# EAGLE schematic StrainGageAmpSMD3v3 (EAGLE 9.1.0)
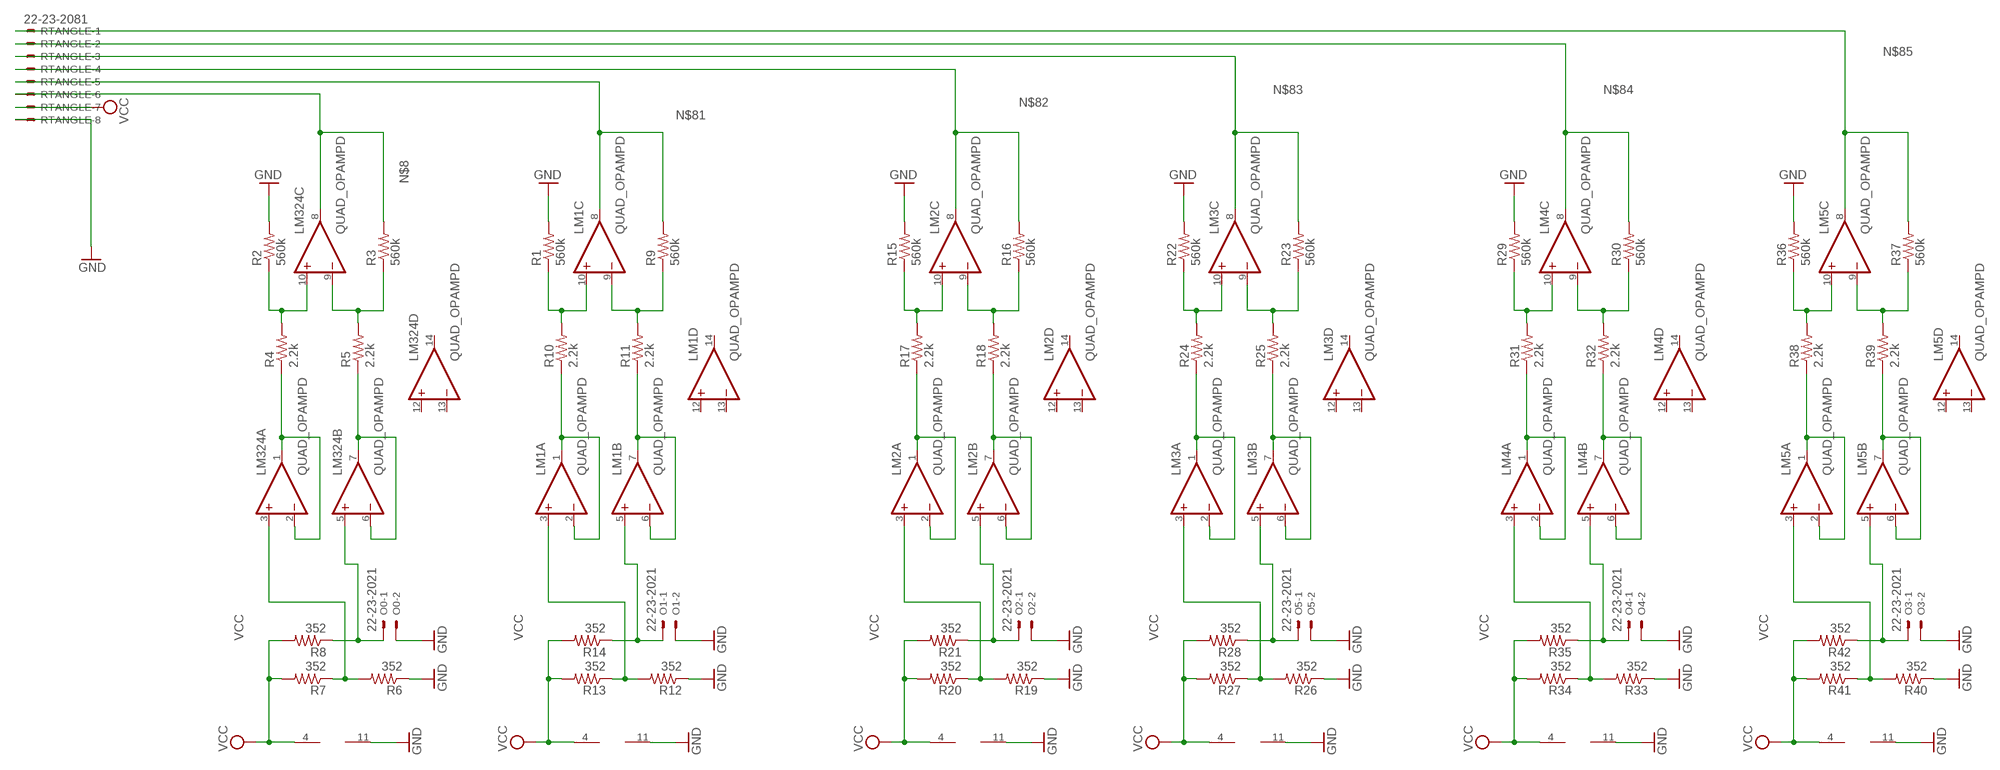
[diagram p0: schematic, sheet 1]

## Parts
LM1  QUAD_OPAMPD  [SO14]
LM2  QUAD_OPAMPD  [SO14]
LM3  QUAD_OPAMPD  [SO14]
LM4  QUAD_OPAMPD  [SO14]
LM5  QUAD_OPAMPD  [SO14]
LM324  QUAD_OPAMPD  [SO14]
O0  22-23-2021  [22-23-2021]
O1  22-23-2021  [22-23-2021]
O2  22-23-2021  [22-23-2021]
O3  22-23-2021  [22-23-2021]
O4  22-23-2021  [22-23-2021]
O5  22-23-2021  [22-23-2021]
R1  560k  R-US_R1206  [R1206]
R2  560k  R-US_R1206  [R1206]
R3  560k  R-US_R1206  [R1206]
R4  2.2k  R-US_R1206  [R1206]
R5  2.2k  R-US_R1206  [R1206]
R6  352  R-US_R0603  [R0603]
R7  352  R-US_R0603  [R0603]
R8  352  R-US_R0603  [R0603]
R9  560k  R-US_R1206  [R1206]
R10  2.2k  R-US_R1206  [R1206]
R11  2.2k  R-US_R1206  [R1206]
R12  352  R-US_R0603  [R0603]
R13  352  R-US_R0603  [R0603]
R14  352  R-US_R0603  [R0603]
R15  560k  R-US_R1206  [R1206]
R16  560k  R-US_R1206  [R1206]
R17  2.2k  R-US_R1206  [R1206]
R18  2.2k  R-US_R1206  [R1206]
R19  352  R-US_R0603  [R0603]
R20  352  R-US_R0603  [R0603]
R21  352  R-US_R0603  [R0603]
R22  560k  R-US_R1206  [R1206]
R23  560k  R-US_R1206  [R1206]
R24  2.2k  R-US_R1206  [R1206]
R25  2.2k  R-US_R1206  [R1206]
R26  352  R-US_R0603  [R0603]
R27  352  R-US_R0603  [R0603]
R28  352  R-US_R0603  [R0603]
R29  560k  R-US_R1206  [R1206]
R30  560k  R-US_R1206  [R1206]
R31  2.2k  R-US_R1206  [R1206]
R32  2.2k  R-US_R1206  [R1206]
R33  352  R-US_R0603  [R0603]
R34  352  R-US_R0603  [R0603]
R35  352  R-US_R0603  [R0603]
R36  560k  R-US_R1206  [R1206]
R37  560k  R-US_R1206  [R1206]
R38  2.2k  R-US_R1206  [R1206]
R39  2.2k  R-US_R1206  [R1206]
R40  352  R-US_R0603  [R0603]
R41  352  R-US_R0603  [R0603]
R42  352  R-US_R0603  [R0603]
RTANGLE  22-23-2081  [22-23-2081]

## Nets
GND: LM1.11(P:V-) LM2.11(P:V-) LM3.11(P:V-) LM4.11(P:V-) LM5.11(P:V-) LM324.11(P:V-) O0.2 O1.2 O2.2 O3.2 O4.2 O5.2 R1.2 R2.2 R6.1 R12.1 R15.2 R19.1 R22.2 R26.1 R29.2 R33.1 R36.2 R40.1 RTANGLE.8
N$1: LM1.3(A:+IN) R12.2 R13.1
N$2: LM324.3(A:+IN) R6.2 R7.1
N$3: LM324.5(B:+IN) O0.1 R8.1
N$4: LM324.1(A:OUT) LM324.2(A:-IN) R4.1
N$5: LM324.6(B:-IN) LM324.7(B:OUT) R5.1
N$6: LM324.9(C:-IN) R3.1 R5.2
N$7: LM324.10(C:+IN) R2.1 R4.2
N$8: LM324.8(C:OUT) R3.2 RTANGLE.6
N$10: LM1.5(B:+IN) O1.1 R14.1
N$11: LM1.1(A:OUT) LM1.2(A:-IN) R10.1
N$12: LM1.6(B:-IN) LM1.7(B:OUT) R11.1
N$13: LM1.9(C:-IN) R9.1 R11.2
N$14: LM1.10(C:+IN) R1.1 R10.2
N$15: LM2.3(A:+IN) R19.2 R20.1
N$16: LM2.5(B:+IN) O2.1 R21.1
N$17: LM2.1(A:OUT) LM2.2(A:-IN) R17.1
N$18: LM2.6(B:-IN) LM2.7(B:OUT) R18.1
N$19: LM2.9(C:-IN) R16.1 R18.2
N$20: LM2.10(C:+IN) R15.1 R17.2
N$21: LM3.3(A:+IN) R26.2 R27.1
N$22: LM3.5(B:+IN) O5.1 R28.1
N$23: LM3.1(A:OUT) LM3.2(A:-IN) R24.1
N$24: LM3.6(B:-IN) LM3.7(B:OUT) R25.1
N$25: LM3.9(C:-IN) R23.1 R25.2
N$26: LM3.10(C:+IN) R22.1 R24.2
N$27: LM4.3(A:+IN) R33.2 R34.1
N$28: LM4.5(B:+IN) O4.1 R35.1
N$29: LM4.1(A:OUT) LM4.2(A:-IN) R31.1
N$30: LM4.6(B:-IN) LM4.7(B:OUT) R32.1
N$31: LM4.9(C:-IN) R30.1 R32.2
N$32: LM4.10(C:+IN) R29.1 R31.2
N$33: LM5.3(A:+IN) R40.2 R41.1
N$34: LM5.5(B:+IN) O3.1 R42.1
N$35: LM5.1(A:OUT) LM5.2(A:-IN) R38.1
N$36: LM5.6(B:-IN) LM5.7(B:OUT) R39.1
N$37: LM5.9(C:-IN) R37.1 R39.2
N$38: LM5.10(C:+IN) R36.1 R38.2
N$81: LM1.8(C:OUT) R9.2 RTANGLE.5
N$82: LM2.8(C:OUT) R16.2 RTANGLE.4
N$83: LM3.8(C:OUT) R23.2 RTANGLE.3
N$84: LM4.8(C:OUT) R30.2 RTANGLE.2
N$85: LM5.8(C:OUT) R37.2 RTANGLE.1
VCC: LM1.4(P:V+) LM2.4(P:V+) LM3.4(P:V+) LM4.4(P:V+) LM5.4(P:V+) LM324.4(P:V+) R7.2 R8.2 R13.2 R14.2 R20.2 R21.2 R27.2 R28.2 R34.2 R35.2 R41.2 R42.2 RTANGLE.7
Unconnected: LM1.12(D:+IN) LM1.13(D:-IN) LM1.14(D:OUT) LM2.12(D:+IN) LM2.13(D:-IN) LM2.14(D:OUT) LM3.12(D:+IN) LM3.13(D:-IN) LM3.14(D:OUT) LM4.12(D:+IN) LM4.13(D:-IN) LM4.14(D:OUT) LM5.12(D:+IN) LM5.13(D:-IN) LM5.14(D:OUT) LM324.12(D:+IN) LM324.13(D:-IN) LM324.14(D:OUT)

## Library data of the parts
LM1-LM5 LM324 = adafruit:QUAD_OPAMP: OP AMP Standard quad package
O0 O1-O5 = con-molex:22-23-2021: .100" (2.54mm) Center Header - 2 Pin; MF: MOLEX; MPN: 22-23-2021; OC_FARNELL: 1462926; OC_NEWARK: 25C3832
R1-R42 = adafruit:R-US_: RESISTOR, American symbol
RTANGLE = con-molex:22-23-2081: .100" (2.54mm) Center Header - 8 Pin; MF: MOLEX; MPN: 22-23-2081; OC_FARNELL: 1756826; OC_NEWARK: 01C7592

## Module AMP
Ports: 

### Library data of the parts

## Net classes
0 default: width 0.203 mm, drill 0.254 mm, clearance 0.254 mm